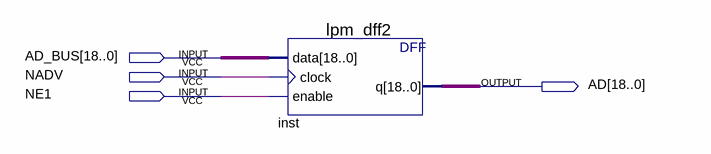
[diagram p0: schematic sheet]
// Quartus schematic latch_address.bdf as structural Verilog: 1 symbols, 4 pins
module latch_address (
  input  [18:0] AD_BUS,
  input  NADV,
  input  NE1,
  output [18:0] AD
);

  lpm_dff2 inst (.data(AD_BUS), .clock(NADV), .enable(NE1), .q(AD));
endmodule
